# Altium project Carga_util_V2.PrjPcb
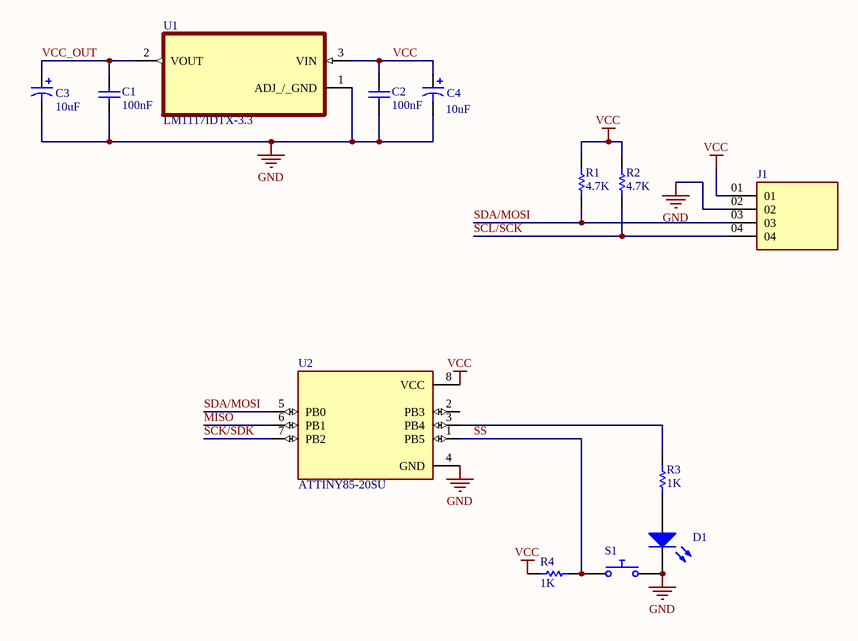
[diagram p0: Carga_util_v2.SchDoc]
1 sheet, 13 parts. Net scope: global (net labels, ports and power ports of the same name join across sheets).
Board file: Carga_util_v2.PcbDoc

## Sheet Carga_util_v2.SchDoc: Carga_util
size A4; Revision: 2.0; SheetNumber: 1; SheetTotal: 1; SPICEModelCacheFESOHUMR: <root> / <DocumentId>FESOHUMR</DocumentId> / </root>

### Parts
C1  value 100nF  (hidden comment: Capacitor)
C2  value 100nF  (hidden comment: Capacitor)
C3  value 10uF  [RB7.6-15]  (hidden comment: Cap Pol1)
C4  value 10uF  [RB7.6-15]  (hidden comment: Cap Pol1)
D1  Light-Emitting Diode  (value not drawn)
J1  TSW-104-07-T-S-LL  [SAMTEC_TSW-104-07-T-S-LL]  (value not drawn)
R1  value 4.7K  (hidden comment: Resistor)
R2  value 4.7K  (hidden comment: Resistor)
R3  value 1K  (hidden comment: Resistor)
R4  value 1K  (hidden comment: Resistor)
S1  Push Button Normally Opened  (value not drawn)
U1  LM1117IDTX-3.3  [TO228P970X238-3N]
U2  ATTINY85-20SU  [SOIC127P798X216-8N]

### Nets
GND: C1.1 C2.1 C3.2 C4.2 D1.2(K) J1.02 S1.2 U1.1(ADJ_/_GND) U2.4(GND)
VCC: C2.2 C4.1 J1.01 R1.2 R2.2 R4.1 U1.3(VIN) U2.8(VCC)
MISO: U2.6(PB1)
SCK/SDK: U2.7(PB2)
SCL/SCK: J1.04 R2.1
SDA/MOSI: J1.03 R1.1 U2.5(PB0)
SS: R4.2 S1.1 U2.1(PB5)
VCC_OUT: C1.2 C3.1 U1.2(VOUT)
NetD1_1: D1.1(A) R3.1
NetR3_2: R3.2 U2.3(PB4)

Not connected (* = marked no-connect by the designer): U2 2(PB3)

### Library data of the parts
C1 C2 = Capacitor: SimulationGenericComponent: True
C3 C4 = Cap Pol1: Polarized Capacitor (Radial); Published: 8-Jun-2000; LatestRevisionDate: 17-Jul-2002; LatestRevisionNote: Re-released for DXP Platform.; PackageReference: RB7.6-15; Publisher: Altium Limited; PackageDescription: Polarized Capacitor (Radial); 2 Leads
D1 = LED: AF: 1; BV: 0; BV_MAX: 1e99; EG: 1.11; FC: 0.5; IBV: 0.001; IS: 1e-14; MJSW: 0.33; NTUN: 30; TNOM: 27; XTI: 3; SimulationGenericComponent: True; CJO: 0; CJP: 0; CTA: 0; CTP: 0; FCS: 0.5; FV_MAX: 1e99; IKF: 0; IKR: 0; ISR: 1e-14; JSW: 0; JTUN: 0; JTUNSW: 0; KEG: 1; KF: 0; LEVEL: 1; N: 1; NBV: 1; NR: 1; NS: 1; PHP: 1; RS: 0; TCV: 0; TLEV: 0; TLEVC: 0; TM1: 0; TM2: 0; TPB: 0; TPHP: 0; TRS: 0; TRS2: 0; TT: 0; TTT1: 0; TTT2: 0; VJ: 1; XTITUN: 3
R1-R4 = Resistor: TC1: 0; SimulationGenericComponent: True; TC2: 0
S1 = Push Button NO: closed: 0; Rclosed: 1m; Ropen: 1Meg; SimulationGenericComponent: True
U1 = LM1117IDTX-3.3: Linear Voltage Regulator IC 1 Output 800mA TO-252-3; MF: Texas Instruments; Check_prices: https://www.snapeda.com/parts/LM1117IDTX-3.3/Texas%20Instruments/view-part/497954/?ref=eda; SnapEDA_Link: https://www.snapeda.com/parts/LM1117IDTX-3.3/Texas%20Instruments/view-part/497954/?ref=snap; Package: TO-252-3 Texas Instruments; Digi-Key_Part_Number: LM1117IDTX-3.3/NOPBCT-ND; MP: LM1117IDTX-3.3; Value: *
U2 = ATTINY85-20SU: AVR AVRÂ® ATtiny, Functional Safety (FuSa) Microcontroller IC 8-Bit 20MHz 8KB (4K x 16) FLASH 8-SOIC; MF: Microchip Technology; Package: SOIC-8 Microchip; Price: None; Check_prices: https://www.snapeda.com/parts/ATTINY85-20SU/Microchip/view-part/?ref=eda; Value: *; SnapEDA_Link: https://www.snapeda.com/parts/ATTINY85-20SU/Microchip/view-part/?ref=snap; MP: ATTINY85-20SU; Availability: In Stock; Purchase-URL: https://pricing.snapeda.com/search?q=ATTINY85-20SU&ref=eda
J1 = TSW-104-07-T-S-LL: Availability: Unavailable; Price: None; MP: TSW-104-07-T-S-LL; Package: None; Value: *